# Altium schematic sheet Schemat_wzmacniacz_PSEL.SchDoc
size 420 x 297 mm; Date: 14.12.2025; Author: Anna Dzieżyk; DrawnBy: Anna Dzieżyk; Engineer: Anna Dzieżyk; SheetNumber: 1; SheetTotal: 1; Project_CopyrightDate: 2025; File_name: Schemat_wzmacniacz_PSEL.SchDoc; Time: 18:00
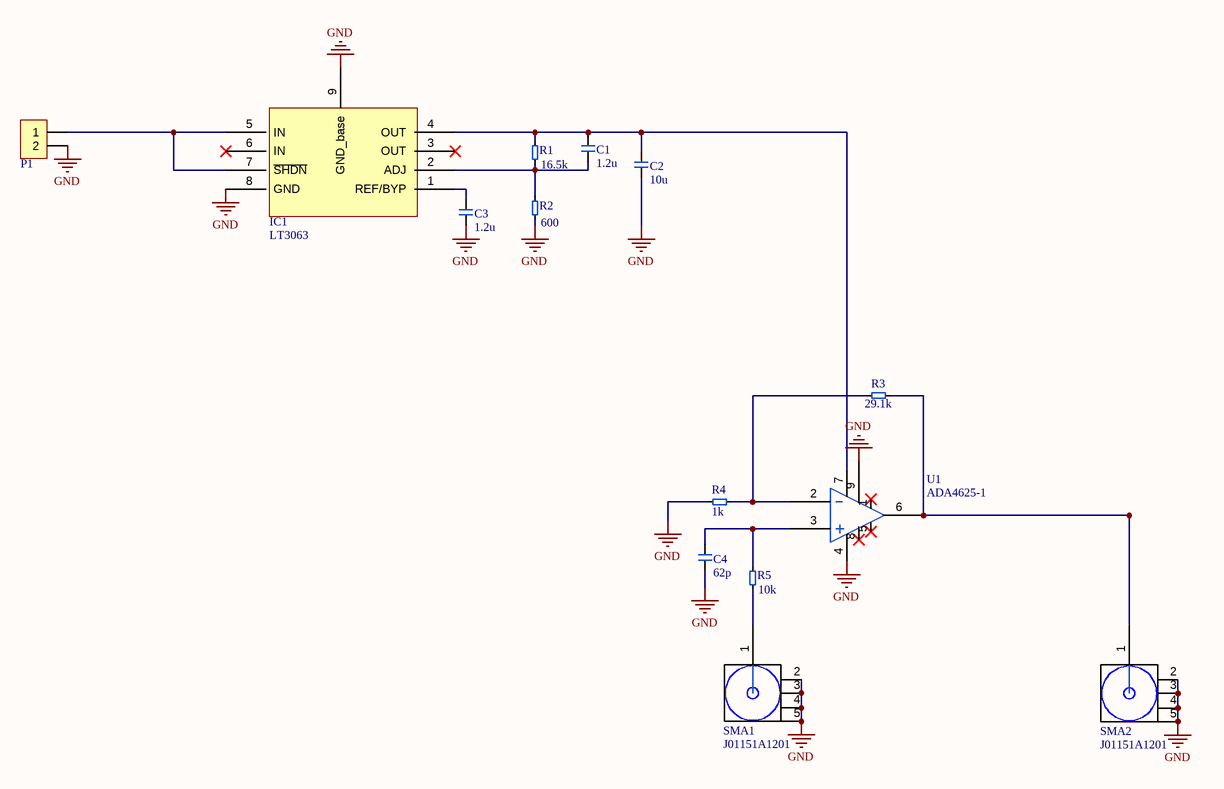
[diagram p0: Schemat_wzmacniacz_PSEL.SchDoc]

## Parts
C1  1.2u  [C0805]
C2  10u  [C0805]
C3  1.2u  [C0805]
C4  62p  [C0805]
IC1  LT3063  [8-Lead Plastic MSOP]
P1  Header 2  [Header-2]  (value not drawn)
R1  16.5k  [R0805]
R2  600  [R0805]
R3  29.1k  [R0805]
R4  1k  [R0805]
R5  10k  [R0805]
SMA1  J01151A1201  [J01151A1201]
SMA2  J01151A1201  [J01151A1201]
U1  ADA4625-1  [SOIC_N_EP]

## Nets
GND: C2.1 C3.1 C4.1 IC1.8(GND) IC1.9(GND_base) P1.2 R2.2 R4.1 SMA1.2 SMA1.3 SMA1.4 SMA1.5 SMA2.2 SMA2.3 SMA2.4 SMA2.5 U1.4 U1.9
NetC1_1: C1.1 IC1.2(ADJ) R1.2 R2.1
NetC1_2: C1.2 C2.2 IC1.4(OUT) R1.1 U1.7
NetC3_2: C3.2 IC1.1(REF/BYP)
NetC4_2: C4.2 R5.1 U1.3
NetIC1_5: IC1.5(IN) IC1.7(~{SHDN}) P1.1
NetR3_1: R3.1 R4.2 U1.2
NetR3_2: R3.2 SMA2.1 U1.6
NetR5_2: R5.2 SMA1.1

Not connected (* = marked no-connect by the designer): IC1 3(OUT)* 6(IN)*; U1 1* 5* 8*

## Notes on the sheet
- Warsaw University of Technology
- WEiTI
- PROJECT TITLE
- SCHEMATIC
- Institute of Electronic Systems
- Nowowiejska 15/19
- 00-655
- Poland
- DATE
- Member of the Polish Electronic Group (PEG)
- CONFIDENTIAL MATERIAL
- All rights reserved ©
- ENGINEER:
- DRAWN BY:
- Revision:
- Size: custom
- Sheet
- FILENAME:
- of

## Library data of the parts
C1 C3 = Cap: Part number: C0805C125K4RACTU; Manufacterer: KEMET; Tolerance: 10%; Package: 0805; Value: 1.2u; Pin count: 2; Footprint type: SMD
C2 = Cap: Part number: 0805X7R106KT1AT; Manufacterer: KYOCERA AVX; Tolerance: 10%; Package: 0805; Value: 10u; Pin count: 2; Footprint type: SMD
C4 = Cap: Part number: 600F620FT250XT; Manufacterer: KYOCERA AVX; Tolerance: 1%; Package: 0805; Value: 62p; Pin count: 2; Footprint type: SMD
IC1 = Linear_regulator: Manufacterer: Linear Technology; Model name: LT3063; Pin count: 8; Package: SO-8; Footprint type: SMD
P1 = Header 2: Header, 2-bin, vertical; Raster: 1.54mm; Pin count: 2; Manufaterer: *; Footprint type: THT; Part number: *; Package: *
R1 = Res: Part number: ERJ-P06F1652V; Manufacterer: Panasonic; Tolerance: 1%; Package: 0805; Footprint type: SMD; Value: 16.5k; Pin count: 2
R2 = Res: Part number: CRCW0805600RFKEAHP; Manufacterer: Vishay; Tolerance: 1%; Package: 0805; Footprint type: SMD; Value: 600; Pin count: 2
R3 = Res: Part number: RN73H2ATTD2912B25; Manufacterer: Vishay/Beischlag; Tolerance: 0.1%; Package: 0805; Footprint type: SMD; Value: 29.1k; Pin count: 2
R4 = Res: Part number: MCU08050E1001BP100; Manufacterer: Vishay; Tolerance: 0.1%; Package: 0805; Footprint type: SMD; Value: 1k; Pin count: 2
R5 = Res: Part number: MCU0805MD1002BP500; Manufacterer: Vishay; Tolerance: 0.1%; Package: 0805; Footprint type: SMD; Value: 10k; Pin count: 2
SMA1 SMA2 = J01151A1201: Manufacterer: Telegärtner; Impedance: 50 ohm; Socket type: SMA; Pin count: 5; Footprint type: SMD; Part number: J01151A1201
U1 = Wzmacniacz operacyjny: Manufacterer: Analog Devices; Model name: ADA4625-1; Pin count: 8; Package: SO-8; Footprint type: SMD